# Altium schematic sheet 大棚环境监测.SchDoc
size A4
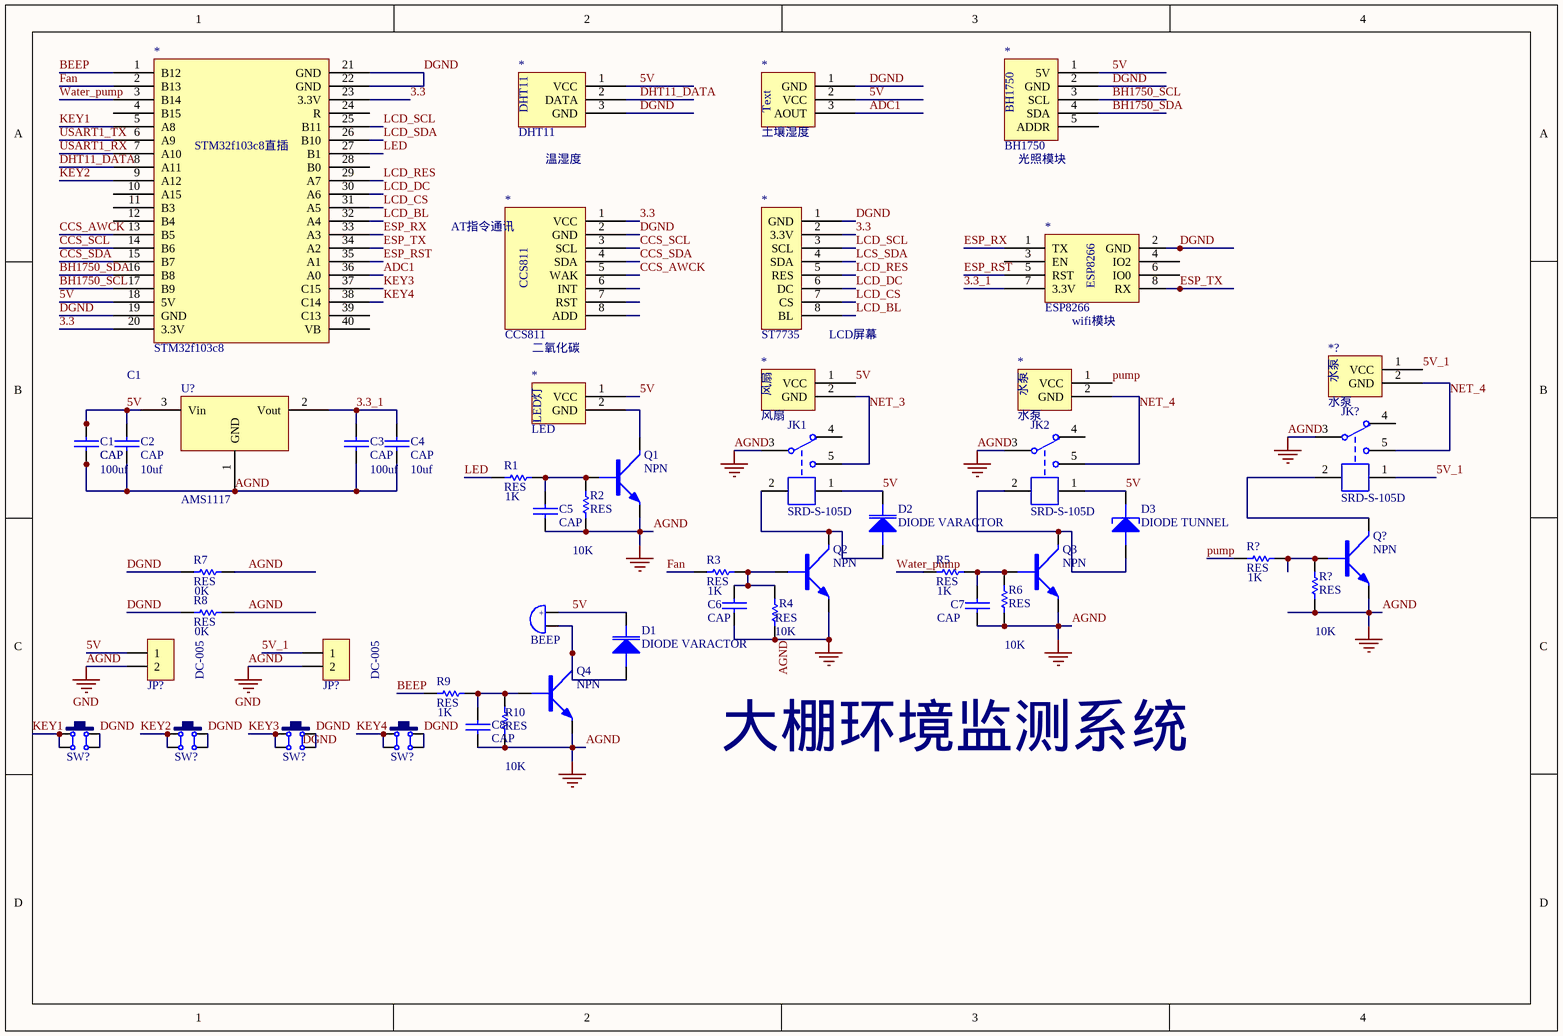
[diagram p0: 大棚环境监测.SchDoc]

## Parts
(Parts that share a designator on the sheet are numbered #1, #2 ... from top to bottom, then left to right.)
*#1  STM32f103c8  [stm32f103c8t6_DIP]
*#2  土壤湿度  [土壤湿度]
*#3  DHT11  [DHT11]
*#4  CCS811  [CCS811]
*#5  ST7735  [ST7735]
*#6  ESP8266  [ESP8266]
*#7  水泵  [水泵]
*#8  风扇  [风扇]
*#9  LED  [LED灯]
*#10  BH1750  [BH1750]
*?  水泵  [水泵]
?  BEEP  [BEEP 5x9x5.5]
C1#1  CAP  [0201C]
C1#2  CAP  [0805C]
C2  CAP  [0805C]
C3  CAP  [0805C]
C4  CAP  [0805C]
C5  CAP  [0805C]
C6  CAP  [0805C]
C7  CAP  [0805C]
C8  CAP  [0805C]
D1  DIODE VARACTOR  [DO-15]
D2  DIODE VARACTOR  [DO-15]
D3  DIODE TUNNEL  [DO-15]
JK1  SRD-S-105D  [SRD-C_BK]
JK2  SRD-S-105D  [SRD-C_BK]
JK?  SRD-S-105D  [SRD-C_BK]
JP?#1  HDR-1X2  [XH2.54-WI-2P]  (value not drawn)
JP?#2  HDR-1X2  [XH2.54-WI-2P]  (value not drawn)
Q1  NPN  [SOT-23]
Q2  NPN  [SOT-23]
Q3  NPN  [SOT-23]
Q4  NPN  [SOT-23]
Q?  NPN  [SOT-23]
R1  RES  [0805R]
R2  RES  [0805R]
R3  RES  [0805R]
R4  RES  [0805R]
R5  RES  [0805R]
R6  RES  [0805R]
R7  RES  [0805R]
R8  RES  [0805R]
R9  RES  [0805R]
R10  RES  [0805R]
R?#1  RES  [0805R]
R?#2  RES  [0805R]
SW?#1  6x6x5  [TSW DIP-6*6*6]  (value not drawn)
SW?#2  6x6x5  [TSW DIP-6*6*6]  (value not drawn)
SW?#3  6x6x5  [TSW DIP-6*6*6]  (value not drawn)
SW?#4  6x6x5  [TSW DIP-6*6*6]  (value not drawn)
U?  AMS1117  [SOT223]

## Nets
AGND: C1#1.1 C1#2.1 C2.1 C3.1 C4.1 C5.1 C6.1 C7.1 C8.1 JK1.3 JK2.3 JK?.3 JP?#1.2 JP?#2.2 Q1.E Q2.E Q3.E Q4.E Q?.E R2.2 R4.2 R6.2 R7.2 R8.2 R10.2 R?#2.2 U?.1(GND)  [also labelled GND]
3.3: *#1.20(3.3V) *#1.23(3.3V) *#4.1(VCC) *#5.2(3.3V)
3.3_1: *#6.7(3.3V) C3.2 C4.2 U?.2(Vout)
5V: *#1.18(5V) *#2.2(VCC) *#3.1(VCC) *#8.1(VCC) *#9.1(VCC) *#10.1(5V) ?.1 C1#1.2 C1#2.2 C2.2 D1.K D2.K D3.K JK1.1 JK2.1 JP?#1.1 U?.3(Vin)
5V_1: *?.1(VCC) JK?.1 JP?#2.1
ADC1: *#1.36(A0) *#2.3(AOUT)
BEEP: *#1.1(B12) R9.1
BH1750_SCL: *#1.17(B9) *#10.3(SCL)
BH1750_SDA: *#1.16(B8) *#10.4(SDA)
CCS_AWCK: *#1.13(B5) *#4.5(WAK)
CCS_SCL: *#1.14(B6) *#4.3(SCL)
CCS_SDA: *#1.15(B7) *#4.4(SDA)
DGND: *#1.19(GND) *#1.21(GND) *#1.22(GND) *#2.1(GND) *#3.3(GND) *#4.2(GND) *#5.1(GND) *#6.2(GND) *#10.2(GND) R7.1 R8.1 SW?#1.2 SW?#1.3 SW?#2.2 SW?#2.3 SW?#3.2 SW?#3.3 SW?#4.2 SW?#4.3
DHT11_DATA: *#1.8(A11) *#3.2(DATA)
ESP_RST: *#1.35(A1) *#6.5(RST)
ESP_RX: *#1.33(A3) *#6.1(TX)
ESP_TX: *#1.34(A2) *#6.8(RX)
Fan: *#1.2(B13) R3.1
KEY1: *#1.5(A8) SW?#1.1 SW?#1.4
KEY2: *#1.9(A12) SW?#2.1 SW?#2.4
KEY3: *#1.37(C15) SW?#3.1 SW?#3.4
KEY4: *#1.38(C14) SW?#4.1 SW?#4.4
LCD_BL: *#1.32(A4) *#5.8(BL)
LCD_CS: *#1.31(A5) *#5.7(CS)
LCD_DC: *#1.30(A6) *#5.6(DC)
LCD_RES: *#1.29(A7) *#5.5(RES)
LCD_SCL: *#1.25(B11) *#5.3(SCL)
LCD_SDA: *#1.26(B10)
LCS_SDA: *#5.4(SDA)
LED: *#1.27(B1) R1.1
NET_3: *#8.2(GND) JK1.5
NET_4: *#7.2(GND) *?.2(GND) JK2.5 JK?.5
pump: *#7.1(VCC) R?#1.1
USART1_RX: *#1.7(A10)
USART1_TX: *#1.6(A9)
Water_pump: *#1.3(B14) R5.1
Net*#9_2: *#9.2(GND) Q1.C
Net?_2: ?.2 D1.A Q4.C
NetC5_2: C5.2 Q1.B R1.2 R2.1
NetC6_2: C6.2 Q2.B R3.2 R4.1
NetC7_2: C7.2 Q3.B R5.2 R6.1
NetC8_2: C8.2 Q4.B R9.2 R10.1
NetD2_A: D2.A JK1.2 Q2.C
NetD3_A: D3.A JK2.2 Q3.C
NetJK?_2: JK?.2 Q?.C
NetQ?_B: Q?.B R?#1.2 R?#2.1

Not connected (* = marked no-connect by the designer): *#1 4(B15) 10(A15) 11(B3) 12(B4) 24(R) 28(B0) 39(C13) 40(VB); *#4 6(INT) 7(RST) 8(ADD); *#6 3(EN) 4(IO2) 6(IO0); *#10 5(ADDR); JK1 4; JK2 4; JK? 4

## Notes on the sheet
- (near *#3) 温湿度
- (near *#10) 光照模块
- AT指令通讯
- (near *#4) 二氧化碳
- (near *#5) LCD屏幕
- (near *#6) wifi模块
- 100uf
- 10uf
- (near C4) 10uf
- (near R1) 1K
- 10K
- (near R?#1) 1K
- 0K
- (near R8) 0K
- 1K
- (near R4) 10K
- (near R5) 1K
- DC-005
- (near R9) 1K
- 大棚环境监测系统
- Labels drawn without touching a wire or pin: DGND
- (in symbol BEEP) +
- (in symbol LED) LED灯
- (in symbol STM32f103c8) STM32f103c8直插
- (in symbol 土壤湿度) Text

## Library data of the parts
? = BEEP: 蜂鸣器
C1#1 C1#2 C2-C8 = CAP: 无极性电容
D1 D2 = DIODE VARACTOR: 变容二极管
D3 = DIODE TUNNEL: 隧道二极管
JK1 JK2 JK? = SRD-S-105D: 5V一组转换
JP?#1 JP?#2 = Header 2: 2P接插件; 版权归属: 源创客; BOM名称: 2P接插件; 学习资源: www.ooocke.com
Q1-Q4 Q? = NPN: NPN三极管
SW?#1-SW?#4 = TSW DIP-6x6: 直插6x6轻触开关; 版权归属: 源创客; BOM名称: 直插6x6轻触开关; 学习资源: www.ooocke.com
U? = AMS1117: 三端稳压芯片